# EAGLE schematic 25062016wearable_v1.1 - Kopie (EAGLE 7.6.0)
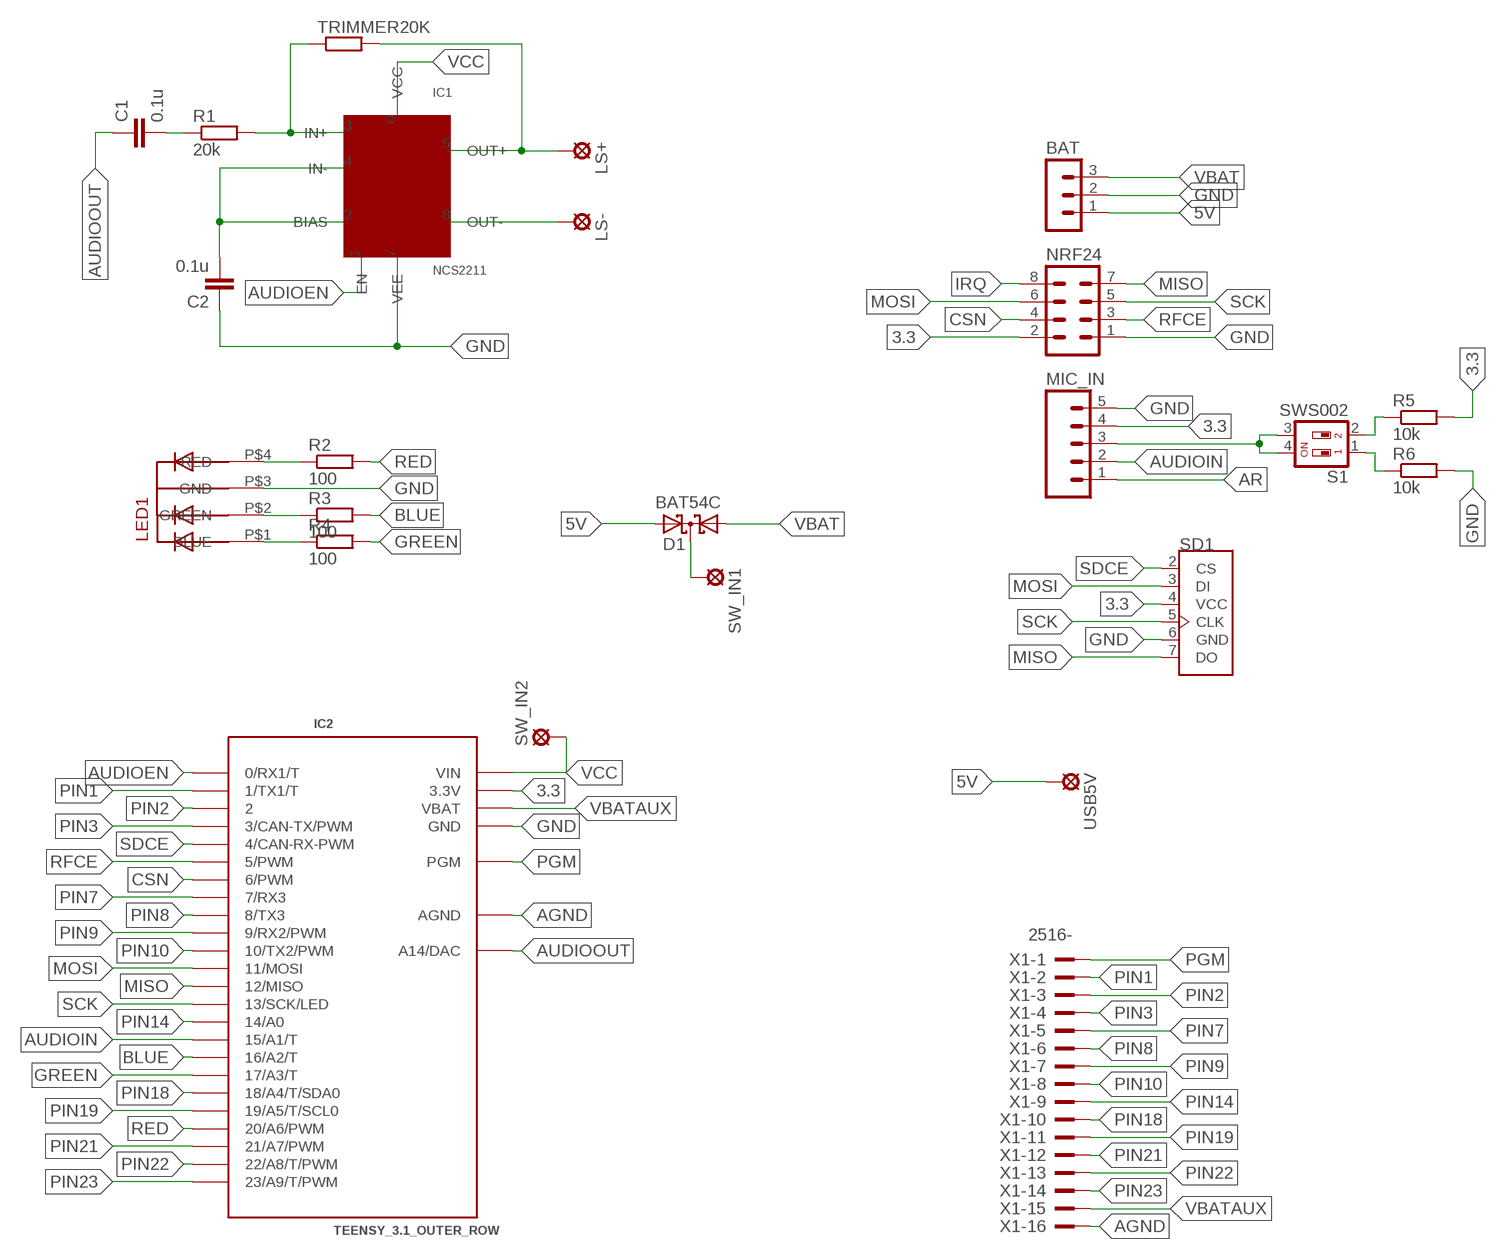
[diagram p0: schematic, sheet 1]

## Parts
BAT  MA03-1  [MA03-1]
C1  0.1u  C2.5/2  [C2.5-2]
C2  0.1u  C2.5/2  [C2.5-2]
D1  BAT54C  [SOT23]
IC1  NCS2211  [SOIC-8]
IC2  TEENSY_3.1_OUTER_ROW  [TEENSY3-OUTER_ROW]
LED1  5MMRGBLED  [LED5MMRGB]
LS+  LSP10  [LSP10]
LS-  LSP10  [LSP10]
MIC_IN  MA05  [05PA]
NRF24  MA04-2  [MA04-2]
R1  20k  R-EU_0204/7  [0204/7]
R2  100  R-EU_0207/2V  [0207/2V]
R3  100  R-EU_0207/2V  [0207/2V]
R4  100  R-EU_0207/2V  [0207/2V]
R5  10k  R-EU_0207/2V  [0207/2V]
R6  10k  R-EU_0207/2V  [0207/2V]
S1  SWS002  [SMS-002]
SD1  MICROSD_SF-MICROSD  [MICROSD_MICROSD]
SW_IN1  SE11  [SE11]
SW_IN2  SE11  [SE11]
TRIMMER20K  R-EU_0207/2V  [0207/2V]
USB5V  LSP10  [LSP10]
X1  2516-  [PAK100/2500-16]

## Nets
3.3 [3.3]: IC2.3.3V IC2.3.3V1(3.3V) MIC_IN.4 NRF24.2 R5.2 SD1.4(VCC)
5V [3.3]: BAT.1 D1.2(A2) USB5V.MP
AGND: IC2.AGND X1.16
AR: MIC_IN.1
AUDIOEN: IC1.1(EN) IC2.0(0/RX1/T)
AUDIOIN: IC2.15/A1(15/A1/T) MIC_IN.2
AUDIOOUT: C1.1 IC2.RESET/DAC(A14/DAC)
BLUE: IC2.16/A2(16/A2/T) R3.2
CSN: IC2.6(6/PWM) NRF24.4
GAIN: MIC_IN.3 S1.3 S1.4
GND [GND]: BAT.2 C2.1 IC1.7(VEE) IC2.GND IC2.GND1(GND) LED1.P$3(GND) MIC_IN.5 NRF24.1 R6.2 SD1.6(GND)
GREEN: IC2.17/A3(17/A3/T) R4.2
IRQ: NRF24.8
MISO: IC2.12(12/MISO) NRF24.7 SD1.7(DO)
MOSI: IC2.11(11/MOSI) NRF24.6 SD1.3(DI)
N$1: D1.3(CC) SW_IN1.MP
N$2: IC1.5(OUT+) LS+.MP TRIMMER20K.2
N$3: IC1.3(IN+) R1.2 TRIMMER20K.1
N$4: C1.2 R1.1
N$5: C2.2 IC1.2(BIAS) IC1.4(IN-)
N$6: IC1.8(OUT-) LS-.MP
N$7: LED1.P$4(RED) R2.1
N$8: LED1.P$1(BLUE) R4.1
N$9: LED1.P$2(GREEN) R3.1
N$11: R5.1 S1.2
N$12: R6.1 S1.1
PGM: IC2.PGM X1.1
PIN1: IC2.1(1/TX1/T) X1.2
PIN2: IC2.2 X1.3
PIN3: IC2.3(3/CAN-TX/PWM) X1.4
PIN7: IC2.7(7/RX3) X1.5
PIN8: IC2.8(8/TX3) X1.6
PIN9: IC2.9(9/RX2/PWM) X1.7
PIN10: IC2.10(10/TX2/PWM) X1.8
PIN14: IC2.14/A0 X1.9
PIN18: IC2.18/A4(18/A4/T/SDA0) X1.10
PIN19: IC2.19/A5(19/A5/T/SCL0) X1.11
PIN21: IC2.21/A7(21/A7/PWM) X1.12
PIN22: IC2.22/A8(22/A8/T/PWM) X1.13
PIN23: IC2.23/A9(23/A9/T/PWM) X1.14
RED: IC2.20/A6(20/A6/PWM) R2.2
RFCE: IC2.5(5/PWM) NRF24.3
SCK: IC2.13(13/SCK/LED) NRF24.5 SD1.5(CLK)
SDCE: IC2.4(4/CAN-RX-PWM) SD1.2(CS)
VBAT [3.3]: BAT.3 D1.1(A1)
VBATAUX: IC2.VBAT X1.15
VCC: IC1.6(VCC) IC2.VIN SW_IN2.MP

## Library data of the parts
BAT = con-lstb:MA03-1: PIN HEADER; OC_FARNELL: unknown; OC_NEWARK: unknown
C1 C2 = capacitor-wima:C: CAPACITOR naming: grid - package width
D1 = diode:BAT54C: Schottky Diodes Source: Fairchild .. BAT54.pdf
IC1 = NCS2211:NCS2211
IC2 = Teensy_3_and_LC_Series_Boards_v1.1:TEENSY_3.1_OUTER_ROW: Footprint for Teensy 3.1 or 3.2 board using all pin connections on the outer perimeter
LED1 = led_rgb:5MMRGBLED
LS+ LS- USB5V = solpad:LSP10: SOLDER PAD drill 1.0 mm, distributor Buerklin, 12H555
MIC_IN = con-amp-quick:MA05: AMP QUICK CONNECTOR; OC_FARNELL: unknown; OC_NEWARK: unknown
NRF24 = con-lstb:MA04-2: PIN HEADER; OC_FARNELL: unknown; OC_NEWARK: unknown
R1-R6 TRIMMER20K = rcl:R-EU_: RESISTOR, European symbol
S1 = smd-special:SWS002: SMD Dip Switch 2 pol.
SD1 = sd:MICROSD_SF-MICROSD
SW_IN1 SW_IN2 = solpad:SE11: SOLDER PAD RTM, drill 1,1mm, distributor Buerklin, 07F810
X1 = con-3m:2516-: 3M (TM) Pak 100 4-Wall Header Source: 3M; OC_FARNELL: unknown; OC_NEWARK: unknown

## Net classes
0 default: width 0.406 mm
1 GND: width 0.61 mm
2 3.3: width 0.61 mm